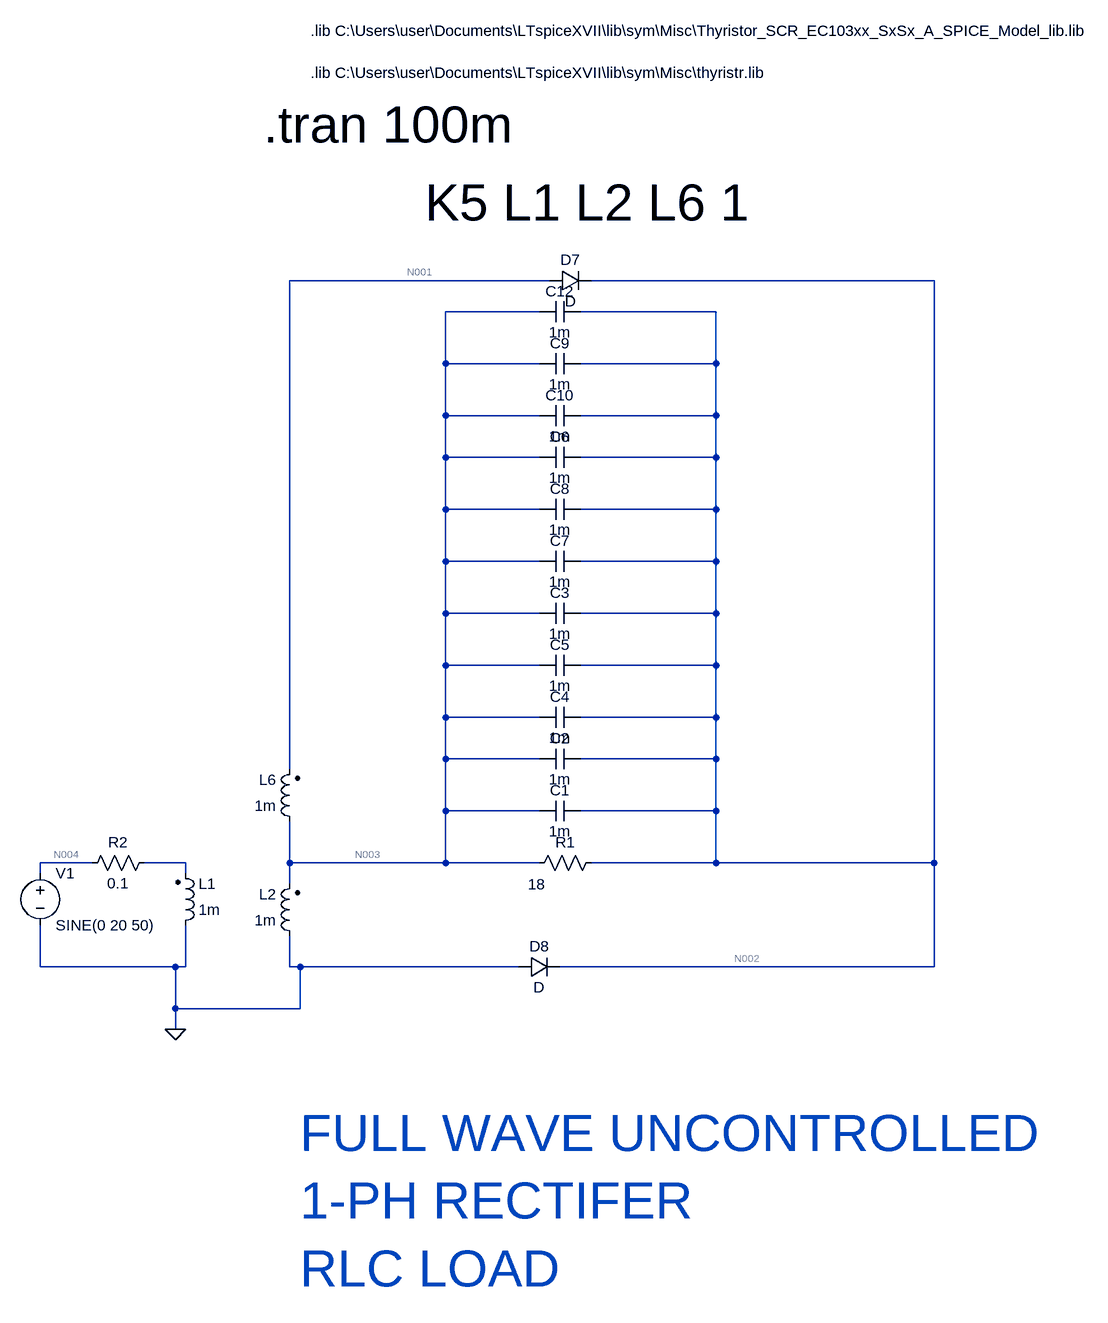
[diagram p0: schematic FULL WAVE RECTIFIER.asc]
FULL WAVE RECTIFIER.asc, the LTspice schematic file:
Version 4
SHEET 1 8784 900
WIRE 3968 -656 3568 -656
WIRE 4560 -656 4032 -656
WIRE 3952 -608 3808 -608
WIRE 4224 -608 4016 -608
WIRE 3808 -528 3808 -608
WIRE 3952 -528 3808 -528
WIRE 4224 -528 4224 -608
WIRE 4224 -528 4016 -528
WIRE 3808 -448 3808 -528
WIRE 3952 -448 3808 -448
WIRE 4224 -448 4224 -528
WIRE 4224 -448 4016 -448
WIRE 3808 -384 3808 -448
WIRE 3952 -384 3808 -384
WIRE 4224 -384 4224 -448
WIRE 4224 -384 4016 -384
WIRE 3808 -304 3808 -384
WIRE 3952 -304 3808 -304
WIRE 4224 -304 4224 -384
WIRE 4224 -304 4016 -304
WIRE 3808 -224 3808 -304
WIRE 3952 -224 3808 -224
WIRE 4224 -224 4224 -304
WIRE 4224 -224 4016 -224
WIRE 3808 -144 3808 -224
WIRE 3952 -144 3808 -144
WIRE 4224 -144 4224 -224
WIRE 4224 -144 4016 -144
WIRE 3808 -64 3808 -144
WIRE 3952 -64 3808 -64
WIRE 4224 -64 4224 -144
WIRE 4224 -64 4016 -64
WIRE 3808 16 3808 -64
WIRE 3952 16 3808 16
WIRE 4224 16 4224 -64
WIRE 4224 16 4016 16
WIRE 3808 80 3808 16
WIRE 3952 80 3808 80
WIRE 4224 80 4224 16
WIRE 4224 80 4016 80
WIRE 3568 96 3568 -656
WIRE 3808 160 3808 80
WIRE 3952 160 3808 160
WIRE 4224 160 4224 80
WIRE 4224 160 4016 160
WIRE 3264 240 3184 240
WIRE 3408 240 3344 240
WIRE 3568 240 3568 176
WIRE 3808 240 3808 160
WIRE 3808 240 3568 240
WIRE 3952 240 3808 240
WIRE 4224 240 4224 160
WIRE 4224 240 4032 240
WIRE 4560 240 4560 -656
WIRE 4560 240 4224 240
WIRE 3184 256 3184 240
WIRE 3408 256 3408 240
WIRE 3568 272 3568 240
WIRE 3184 400 3184 336
WIRE 3392 400 3184 400
WIRE 3408 400 3408 336
WIRE 3408 400 3392 400
WIRE 3568 400 3568 352
WIRE 3584 400 3568 400
WIRE 3920 400 3584 400
WIRE 4560 400 4560 240
WIRE 4560 400 3984 400
WIRE 3392 464 3392 400
WIRE 3584 464 3584 400
WIRE 3584 464 3392 464
WIRE 3392 496 3392 464
FLAG 3392 496 0
SYMBOL ind2 3392 352 M180
WINDOW 0 36 80 Left 2
WINDOW 3 36 40 Left 2
SYMATTR InstName L1
SYMATTR Value 1m
SYMATTR Type ind
SYMBOL ind2 3584 368 R180
WINDOW 0 36 80 Left 2
WINDOW 3 36 40 Left 2
SYMATTR InstName L2
SYMATTR Value 1m
SYMATTR Type ind
SYMBOL res 4048 224 R90
WINDOW 0 0 56 VBottom 2
WINDOW 3 33 100 VTop 2
SYMATTR InstName R1
SYMATTR Value 18
SYMBOL cap 4016 144 R90
WINDOW 0 0 32 VBottom 2
WINDOW 3 32 32 VTop 2
SYMATTR InstName C1
SYMATTR Value 1m
SYMBOL res 3360 224 R90
WINDOW 0 0 56 VBottom 2
WINDOW 3 32 56 VTop 2
SYMATTR InstName R2
SYMATTR Value 0.1
SYMBOL voltage 3184 240 R0
WINDOW 123 0 0 Left 0
WINDOW 39 0 0 Left 0
SYMATTR InstName V1
SYMATTR Value SINE(0 20 50)
SYMBOL ind2 3584 192 R180
WINDOW 0 36 80 Left 2
WINDOW 3 36 40 Left 2
SYMATTR InstName L6
SYMATTR Value 1m
SYMATTR Type ind
SYMBOL diode 3968 -640 R270
WINDOW 0 32 32 VTop 2
WINDOW 3 0 32 VBottom 2
SYMATTR InstName D7
SYMBOL diode 3920 416 R270
WINDOW 0 32 32 VTop 2
WINDOW 3 0 32 VBottom 2
SYMATTR InstName D8
SYMBOL cap 4016 64 R90
WINDOW 0 0 32 VBottom 2
WINDOW 3 32 32 VTop 2
SYMATTR InstName C2
SYMATTR Value 1m
SYMBOL cap 4016 -160 R90
WINDOW 0 0 32 VBottom 2
WINDOW 3 32 32 VTop 2
SYMATTR InstName C3
SYMATTR Value 1m
SYMBOL cap 4016 0 R90
WINDOW 0 0 32 VBottom 2
WINDOW 3 32 32 VTop 2
SYMATTR InstName C4
SYMATTR Value 1m
SYMBOL cap 4016 -80 R90
WINDOW 0 0 32 VBottom 2
WINDOW 3 32 32 VTop 2
SYMATTR InstName C5
SYMATTR Value 1m
SYMBOL cap 4016 -400 R90
WINDOW 0 0 32 VBottom 2
WINDOW 3 32 32 VTop 2
SYMATTR InstName C6
SYMATTR Value 1m
SYMBOL cap 4016 -240 R90
WINDOW 0 0 32 VBottom 2
WINDOW 3 32 32 VTop 2
SYMATTR InstName C7
SYMATTR Value 1m
SYMBOL cap 4016 -320 R90
WINDOW 0 0 32 VBottom 2
WINDOW 3 32 32 VTop 2
SYMATTR InstName C8
SYMATTR Value 1m
SYMBOL cap 4016 -544 R90
WINDOW 0 0 32 VBottom 2
WINDOW 3 32 32 VTop 2
SYMATTR InstName C9
SYMATTR Value 1m
SYMBOL cap 4016 -464 R90
WINDOW 0 0 32 VBottom 2
WINDOW 3 32 32 VTop 2
SYMATTR InstName C10
SYMATTR Value 1m
SYMBOL cap 4016 -624 R90
WINDOW 0 0 32 VBottom 2
WINDOW 3 32 32 VTop 2
SYMATTR InstName C12
SYMATTR Value 1m
TEXT 3528 -896 Left 6 !.tran 100m
TEXT 3600 -976 Left 2 !.lib C:\\Users\\user\\Documents\\LTspiceXVII\\lib\\sym\\Misc\\thyristr.lib
TEXT 3600 -1040 Left 2 !.lib C:\\Users\\user\\Documents\\LTspiceXVII\\lib\\sym\\Misc\\Thyristor_SCR_EC103xx_SxSx_A_SPICE_Model_lib.lib
TEXT 3776 -776 Left 6 !K5 L1 L2 L6 1
TEXT 3584 656 Left 6 ;FULL WAVE UNCONTROLLED\n1-PH RECTIFER\nRLC LOAD

The netlist it stands for:
* FULL WAVE RECTIFIER.asc
L1 0 N005 1m
L2 0 N003 1m
R1 N002 N003 18
C1 N002 N003 1m
R2 N005 N004 0.1
V1 N004 0 SINE(0 20 50)
L6 N003 N001 1m
D7 N001 N002 D
D8 0 N002 D
C2 N002 N003 1m
C3 N002 N003 1m
C4 N002 N003 1m
C5 N002 N003 1m
C6 N002 N003 1m
C7 N002 N003 1m
C8 N002 N003 1m
C9 N002 N003 1m
C10 N002 N003 1m
C12 N002 N003 1m
.model D D
.lib standard.dio
.tran 100m
.lib C:\Users\user\Documents\LTspiceXVII\lib\sym\Misc\thyristr.lib
.lib C:\Users\user\Documents\LTspiceXVII\lib\sym\Misc\Thyristor_SCR_EC103xx_SxSx_A_SPICE_Model_lib.lib
K5 L1 L2 L6 1
* FULL WAVE UNCONTROLLED
* 1-PH RECTIFER
* RLC LOAD
.backanno
.end

* Results of the author's LTspice run, read from the files saved beside the schematic
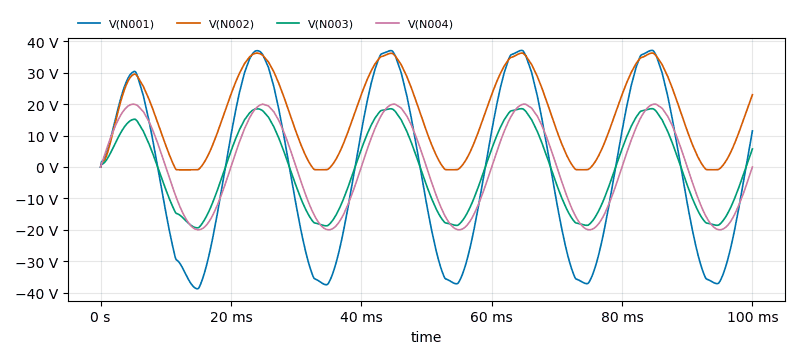
[diagram p1: Transient Analysis of FULL WAVE RECTIFIER.asc, plotted from the saved traces]
* Transient Analysis, 1 run:
*   V(N001): min -38.8 V, max 37.14 V, average -1.171 V, rms 26.11 V, last 11.48 V
*   V(N002): min -915.8 mV, max 36.28 V, average 16.13 V, rms 20.75 V, last 23.01 V
*   V(N003): min -19.4 V, max 18.57 V, average -585.7 mV, rms 13.05 V, last 5.741 V
*   V(N004): min -20 V, max 20 V, average -13.08 mV, rms 14.14 V, last 0 V